# EAGLE schematic 14145^5 (EAGLE 7.6.0)
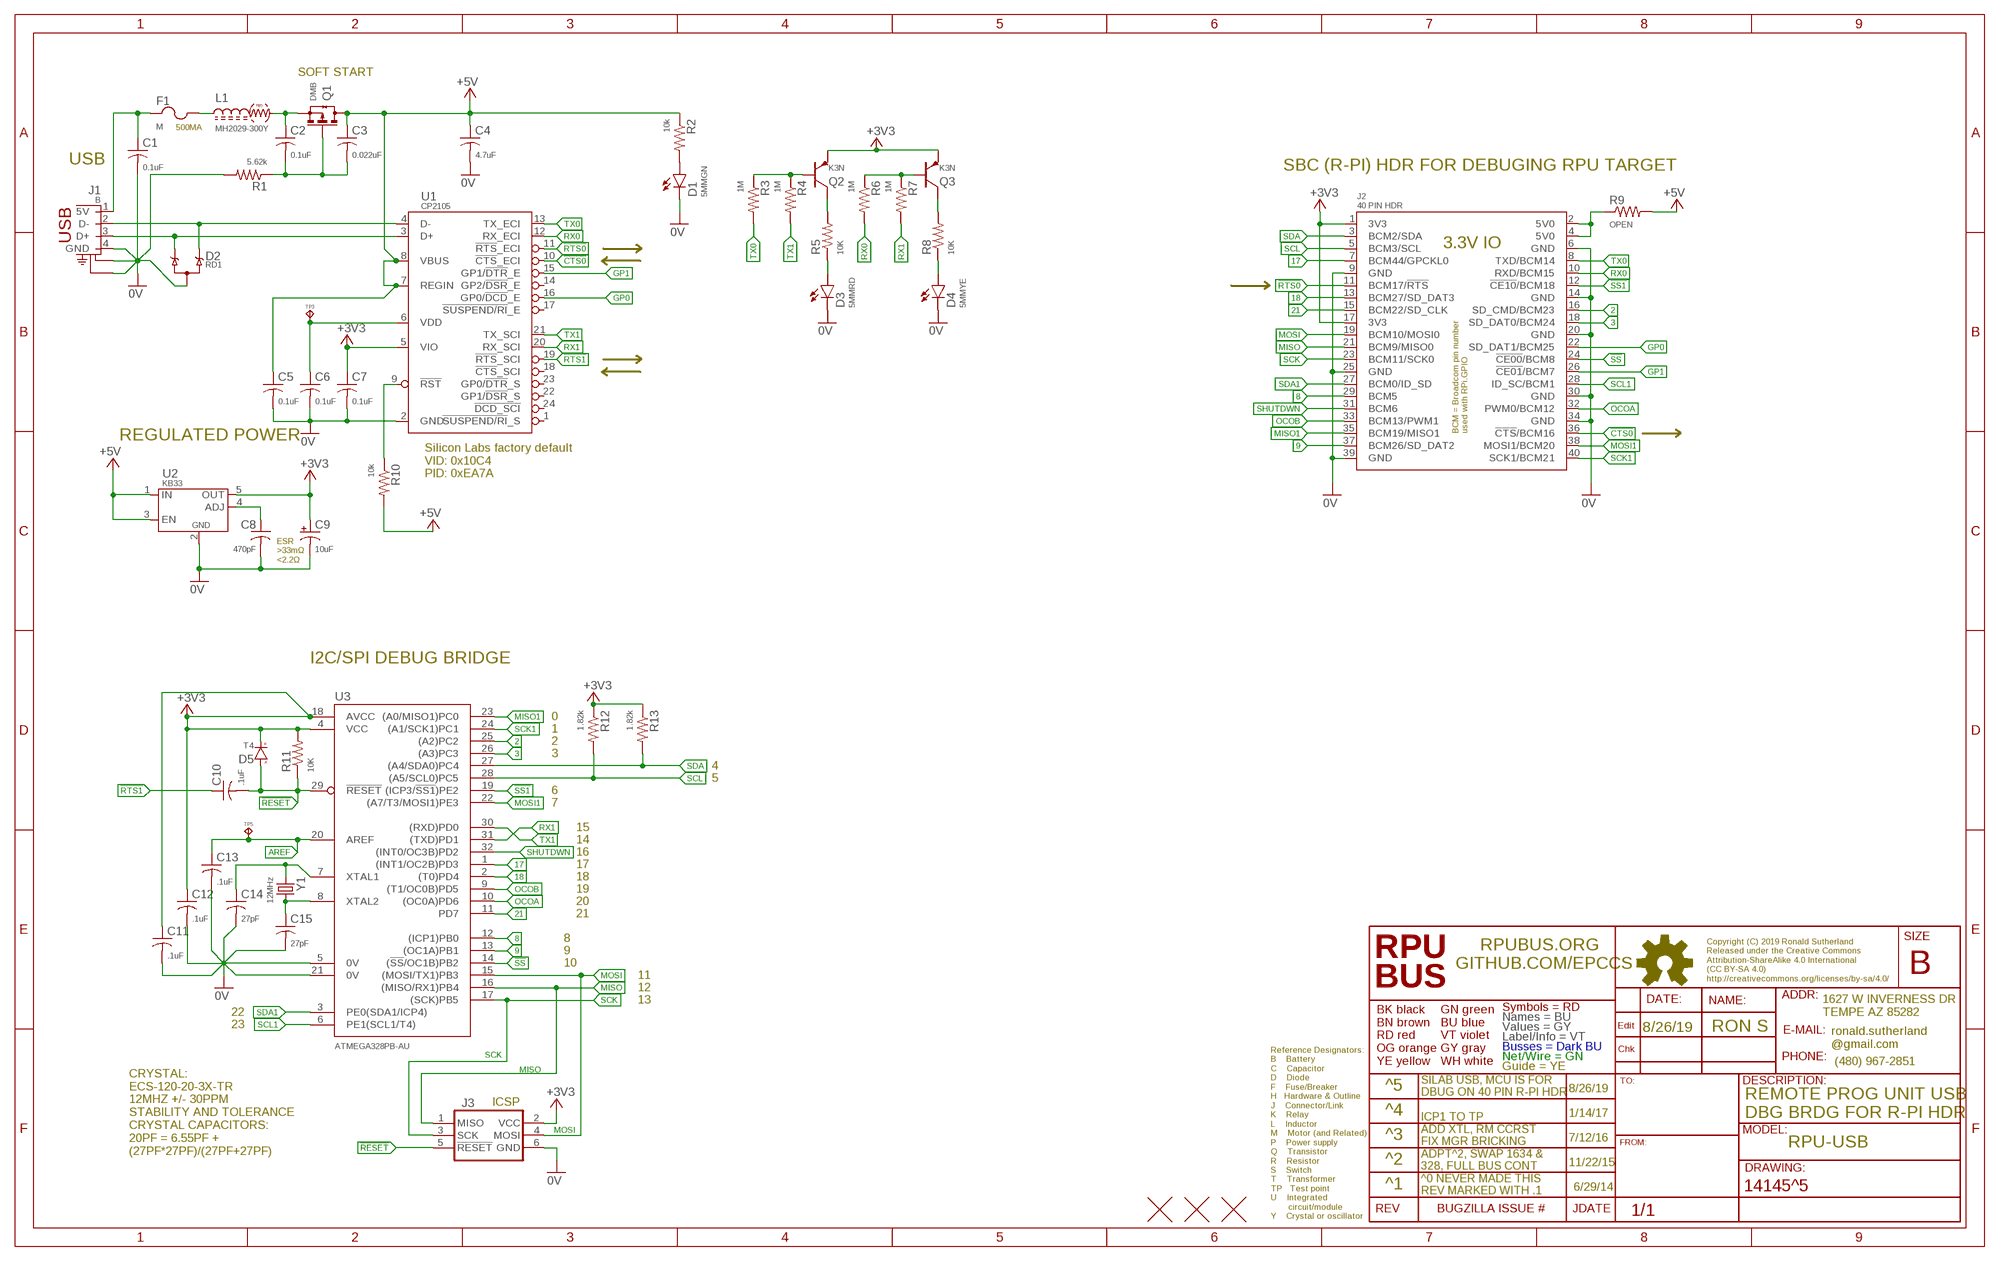
[diagram p0: schematic, sheet 1]

## Parts
C1  0.1uF  CC0603A  [C0603(1608)]
C2  0.1uF  CC0603A  [C0603(1608)]
C3  0.022uF  CC0603A  [C0603(1608)]
C4  4.7uF  CC1206  [C1206(3216)]
C5  0.1uF  CC0603A  [C0603(1608)]
C6  0.1uF  CC0603A  [C0603(1608)]
C7  0.1uF  CC0603A  [C0603(1608)]
C8  470pF  CC0603A  [C0603(1608)]
C9  10uF  CT1206  [3216]
C10  .1uF  CC0603A  [C0603(1608)]
C11  .1uF  CC0603A  [C0603(1608)]
C12  .1uF  CC0603A  [C0603(1608)]
C13  .1uF  CC0603A  [C0603(1608)]
C14  27pF  CC0603A  [C0603(1608)]
C15  27pF  CC0603A  [C0603(1608)]
D1  5MMGN  LED5MM  [LED5MM]
D2  RD1  TVS-2UNI  [SOT23]
D3  5MMRD  LED5MM  [LED5MM]
D4  5MMYE  LED5MM  [LED5MM]
D5  T4  DSOD123  [SOD123]
F1  M  SMD1210  [C1210(3225)]
J1  B  [USB-B-PTH]
J2  40 PIN HDR  RPI-ZERO  [RASPI_ZERO_H40PIN]
J3  ISP-SPIPTH  [ISP]
L1  MH2029-300Y  L0805  [C0805(2012)]
Q1  DMB  N-CHSOT23  [SOT23]
Q2  K3N  PNPSOT23  [SOT23]
Q3  K3N  PNPSOT23  [SOT23]
R1  5.62k  R0805  [C0805(2012)]
R2  10k  R0805  [C0805(2012)]
R3  1M  R0805  [C0805(2012)]
R4  1M  R0805  [C0805(2012)]
R5  10K  R0805  [C0805(2012)]
R6  1M  R0805  [C0805(2012)]
R7  1M  R0805  [C0805(2012)]
R8  10K  R0805  [C0805(2012)]
R9  OPEN  R0805  [C0805(2012)]
R10  10k  R0805  [C0805(2012)]
R11  10K  R0805  [C0805(2012)]
R12  1.82k  R0805  [C0805(2012)]
R13  1.82k  R0805  [C0805(2012)]
TP3  TPPAD1-08  [P1-08]
TP5  TPPAD1-08  [P1-08]
U1  CP2105  [QFN24]
U2  KB33  MIC5205  [SOT23-5,SOT25]
U3  ATMEGA328PB-AU  [TQFP32-08]
U$2  FIDUCIAL1.27  [FIDUCIAL-1.27]
U$3  FIDUCIAL1.27  [FIDUCIAL-1.27]
U$4  FIDUCIAL1.27  [FIDUCIAL-1.27]
Y1  12MHz  CSM-3X  [CSM-3X]

## Nets
0V: C1.2 C4.2 C5.2 C6.2 C7.2 C8.2 C9.- C11.2 C12.2 C13.2 C14.2 C15.2 D1.K D2.3(A) D3.K D4.K J1.4(GND) J1.S1(CHASSIS1) J1.S2(CHASSIS2) J2.6(GND) J2.9(GND) J2.14(GND) J2.20(GND) J2.25(GND) J2.30(GND) J2.34(GND) J2.39(GND) J3.6(GND) R1.2 U1.2(GND) U2.2(GND) U3.5(0V) U3.21(0V)
2: J2.16(SD_CMD/BCM23) U3.25((A2)PC2)
3: J2.18(SD_DAT0/BCM24) U3.26((A3)PC3)
5V0@2: J2.2(5V0) J2.4(5V0) R9.1
8: J2.29(BCM5) U3.12((ICP1)PB0)
9: J2.37(BCM26/SD_DAT2) U3.13((OC1A)PB1)
17: J2.7(BCM44/GPCKL0) U3.1((INT1/OC2B)PD3)
18: J2.13(BCM27/SD_DAT3) U3.2((T0)PD4)
21: J2.15(BCM22/SD_CLK) U3.11(PD7)
!CTS0: J2.36(!CTS!/BCM16) U1.10(!CTS!_ECI)
!RESET: C10.2 D5.A J3.5(!RESET) R11.1 U3.29(!RESET)
!RTS0: J2.11(BCM17/!RTS!) U1.11(!RTS!_ECI)
!RTS1: C10.1 U1.19(!RTS!_SCI)
!SS1!: J2.12(!CE10!/BCM18) U3.19((ICP3/!SS1!)PE2)
!SS!: J2.24(!CE00!/BCM8) U3.14((!SS!/OC1B)PB2)
+3V3: C7.1 C9.+ C11.1 C12.1 D5.C(K) J2.1(3V3) J2.17(3V3) J3.2(VCC) Q2.E Q3.E R11.2 R12.1 R13.1 U1.5(VIO) U2.5(OUT) U3.4(VCC) U3.18(AVCC)
+5V: C3.1 C4.1 C5.1 Q1.3(D)(D) R2.1 R9.2 R10.2 U1.7(REGIN) U1.8(VBUS) U2.1(IN) U2.3(EN)
AREF: C13.1 TP5.TP U3.20(AREF)
D+: D2.1(C1) J1.3(D+) U1.3(D+)
D-: D2.2(C2) J1.2(D-) U1.4(D-)
FTDI3V3: C6.1 TP3.TP U1.6(VDD)
GP0: J2.22(SD_DAT1/BCM25) U1.16(GP0/!DCD!_E)
GP1: J2.26(!CE01!/BCM7) U1.15(GP1/!DTR!_E)
MISO: J2.21(BCM9/MISO0) J3.1(MISO) U3.16((MISO/RX1)PB4)
MISO1: J2.35(BCM19/MISO1) U3.23((A0/MISO1)PC0)
MOSI: J2.19(BCM10/MOSI0) J3.4(MOSI) U3.15((MOSI/TX1)PB3)
MOSI1: J2.38(MOSI1/BCM20) U3.22((A7/T3/MOSI1)PE3)
N$1: D1.A R2.2
N$2: D4.A R8.1
N$3: Q3.C R8.2
N$4: C1.1 F1.1 J1.1(5V)
N$5: F1.2 L1.1
N$6: D3.A R5.1
N$7: R10.1 U1.9(!RST!)
N$8: Q2.C R5.2
N$9: Q2.B R3.1 R4.1
N$17: Q3.B R6.1 R7.1
N$24: C8.1 U2.4(ADJ)
N$26: C2.1 L1.2 Q1.2(S)(S)
N$27: C2.2 C3.2 Q1.1(G)(G) R1.1
OCOA: J2.32(PWM0/BCM12) U3.10((OC0A)PD6)
OCOB: J2.33(BCM13/PWM1) U3.9((T1/OC0B)PD5)
RX0: J2.10(RXD/BCM15) R6.2 U1.12(RX_ECI)
RX1: R7.2 U1.20(RX_SCI) U3.31((TXD)PD1)
SCK: J2.23(BCM11/SCK0) J3.3(SCK) U3.17((SCK)PB5)
SCK1: J2.40(SCK1/BCM21) U3.24((A1/SCK1)PC1)
SCL: J2.5(BCM3/SCL) R12.2 U3.28((A5/SCL0)PC5)
SCL1: J2.28(ID_SC/BCM1) U3.6(PE1(SCL1/T4))
SDA: J2.3(BCM2/SDA) R13.2 U3.27((A4/SDA0)PC4)
SDA1: J2.27(BCM0/ID_SD) U3.3(PE0(SDA1/ICP4))
SHUTDWN: J2.31(BCM6) U3.32((INT0/OC3B)PD2)
TX0: J2.8(TXD/BCM14) R3.2 U1.13(TX_ECI)
TX1: R4.2 U1.21(TX_SCI) U3.30((RXD)PD0)
XTAL1: C14.1 U3.7(XTAL1) Y1.1
XTAL2: C15.1 U3.8(XTAL2) Y1.2
Unconnected: U1.1(!SUSPEND/RI!_S) U1.14(GP2/!DSR!_E) U1.17(!SUSPEND/RI!_E) U1.18(!CTS!_SCI) U1.22(GP1/!DSR!_S) U1.23(GP0/!DTR!_S) U1.24(!DCD_SCI!)

## Notes on the sheet
- SOFT START
- 500MA
- USB
- SBC (R-PI) HDR FOR DEBUGING RPU TARGET
- REGULATED POWER
- Silicon Labs factory default
  VID: 0x10C4
  PID: 0xEA7A
- ESR
  >33mΩ
  <2.2Ω
- I2C/SPI DEBUG BRIDGE
- 0
- 1
- 2
- 3
- 4
- 5
- 6
- 7
- 15
- 14
- 16
- 17
- 18
- 19
- 20
- 21
- 8
- 9
- 10
- 11
- 12
- 13
- 22
- 23
- 8/26/19 | RON S
- ^5 | 8/26/19
- SILAB USB, MCU IS FOR
  DBUG ON 40 PIN R-PI HDR
- ICSP
- ^4 | 1/14/17
- REMOTE PROG UNIT USB 
  DBG BRDG FOR R-PI HDR
- ICP1 TO TP
- ^3 | 7/12/16
- ADD XTL, RM CCRST
  FIX MGR BRICKING
- RPU-USB
- CRYSTAL:
  ECS-120-20-3X-TR 
  12MHZ +/- 30PPM
  STABILITY AND TOLERANCE
  CRYSTAL CAPACITORS:
  20PF = 6.55PF +
  (27PF*27PF)/(27PF+27PF)
- ^2 | 11/22/15
- ADPT^2, SWAP 1634 &
  328, FULL BUS CONT
- ^1 | 6/29/14
- ^0 NEVER MADE THIS
  REV MARKED WITH .1

## Library data of the parts
C1-C8 C10-C15 = C-C:C: CAPACITOR Symbol
C9 = C-T:CT: Tantalum Electrolytic Capacitor
D1 D3 D4 = D-LED:LED: LED 120120WH [CREE,XHGAWT-00-0000-00000HXE1] LED WHITE 6500K 150LUM-W120120
D2 = D-TVS:TVS-2UNI: 2 Unidirectional Channels e.g., DESDA5V3L [DIODES@DESDA5V3L-7] TVS DIODE 3V 15V SOT23 MARK: RD1
D5 = D-GP:D: DIODE
F1 = F-RST:SMD: Fuse i.e. Bourns, MF-USMF075-2
J1 = J-USB:B: B [MOLEX,0670688000] USB B THROUGH HOLE
J2 = U-Pi:RPI-ZERO: Raspberry Pi Zero https://pinout.xyz/ NOTE: WiFi is needed see https://www.kickstarter.com/projects/1991736672/iot-hat-for-raspberry-pi-a-must-have-for-pi-zero
J3 = U-AVR:ISP-SPI: AVR ISP thru SPI In-System Programming uses the target Atmel AVR’s internal SPI (Serial Peripheral Interface) to download code into the flash and EEPROM memories. It is not a debugging interface. When designing an application PCB which includes an AVR with the SPI interface, this pinout should be used. Sparkfun SKU: BOB-08508
L1 = L-FB:L: Ferrite Bead with frequency dependent resistance
Q1 = Q-PCH:N-CH?*: ENHANCEMENT MODE MOSFET SOT23 is BSS138 pinout
Q2 Q3 = Q-PNP:PNP: BJT NPN General Purpose Amplifier
R1-R13 = R-C:R: Resiistor American-style symbol
TP3 TP5 = J-TP:TP: Test pad
U1 = U-Transceiver:CP2105: CP2105 SILABS@CP2105-F01-GMR TRANSCEIVER USB DUAL UART 24QFN
U2 = P-DCDC:MIC5205: KB33 [MICREL,MIC5205-3.3YM5] REG ULDO 3V3 150MA SOT23-5
U3 = U-AVR:ATMEGA328PB-AU: ATmega328PB 4 Kbytes FLASH 128 bytes SRAM 256 bytes EEPROM 2 UART, 2 I2C, 2 SPI 8-channel 10 bit ADC
U$2-U$4 = H-Fiducial:FIDUCIAL: Fiducial Alignment Points Various fiducial points for machine vision alignment.
Y1 = Y-XTL:CSM: 16MHZ20 [ECS,ECS-160-20-3X-TR] CRYSTAL 16MHZ 20PF 30PPM CSM-3X

## Net classes
0 default: width 0.178 mm, drill 0.33 mm